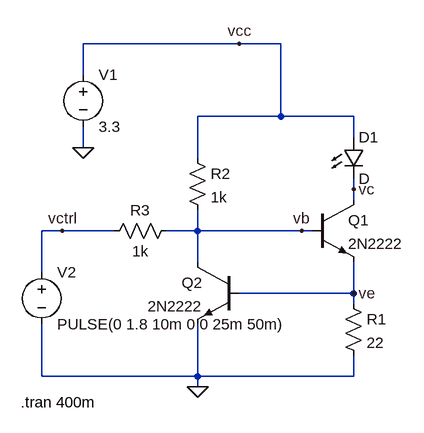
[diagram p0: schematic constant_current_led_driver.asc]
constant_current_led_driver.asc, the LTspice schematic file:
Version 4
SHEET 1 880 680
WIRE 48 -224 -192 -224
WIRE 112 -224 48 -224
WIRE -192 -176 -192 -224
WIRE 112 -112 112 -224
WIRE 112 -112 -16 -112
WIRE 224 -112 112 -112
WIRE 224 -80 224 -112
WIRE -192 -64 -192 -96
WIRE -16 -48 -16 -112
WIRE 224 0 224 -16
WIRE 224 16 224 0
WIRE -224 64 -256 64
WIRE -144 64 -224 64
WIRE -16 64 -16 32
WIRE -16 64 -64 64
WIRE 144 64 -16 64
WIRE 160 64 144 64
WIRE -16 112 -16 64
WIRE -256 128 -256 64
WIRE 224 160 224 112
WIRE 224 160 48 160
WIRE 224 176 224 160
WIRE -256 288 -256 208
WIRE -16 288 -16 208
WIRE -16 288 -256 288
WIRE 224 288 224 256
WIRE 224 288 -16 288
WIRE -16 304 -16 288
FLAG -16 304 0
FLAG -192 -64 0
FLAG 48 -224 vcc
FLAG -224 64 vctrl
FLAG 224 0 vc
FLAG 224 160 ve
FLAG 144 64 vb
SYMBOL res 208 160 R0
SYMATTR InstName R1
SYMATTR Value 22
SYMBOL res -32 -64 R0
SYMATTR InstName R2
SYMATTR Value 1k
SYMBOL npn 160 16 R0
SYMATTR InstName Q1
SYMATTR Value 2N2222
SYMBOL npn 48 112 M0
SYMATTR InstName Q2
SYMATTR Value 2N2222
SYMBOL LED 208 -80 R0
SYMATTR InstName D1
SYMBOL voltage -192 -192 R0
WINDOW 123 0 0 Left 0
WINDOW 39 0 0 Left 0
SYMATTR InstName V1
SYMATTR Value 3.3
SYMBOL voltage -256 112 R0
WINDOW 123 0 0 Left 0
WINDOW 39 0 0 Left 0
SYMATTR InstName V2
SYMATTR Value PULSE(0 1.8 10m 0 0 25m 50m)
SYMBOL res -48 48 R90
WINDOW 0 0 56 VBottom 2
WINDOW 3 32 56 VTop 2
SYMATTR InstName R3
SYMATTR Value 1k
TEXT -288 328 Left 2 !.tran 400m

The netlist it stands for:
* constant_current_led_driver.asc
R1 ve 0 22
R2 vcc vb 1k
Q1 vc vb ve 0 2N2222
Q2 vb ve 0 0 2N2222
D1 vcc vc D
V1 vcc 0 3.3
V2 vctrl 0 PULSE(0 1.8 10m 0 0 25m 50m)
R3 vb vctrl 1k
.model D D
.lib standard.dio
.model NPN NPN
.model PNP PNP
.lib standard.bjt
.tran 400m
.backanno
.end